# EAGLE design prototype2 (EAGLE 7.4.0)
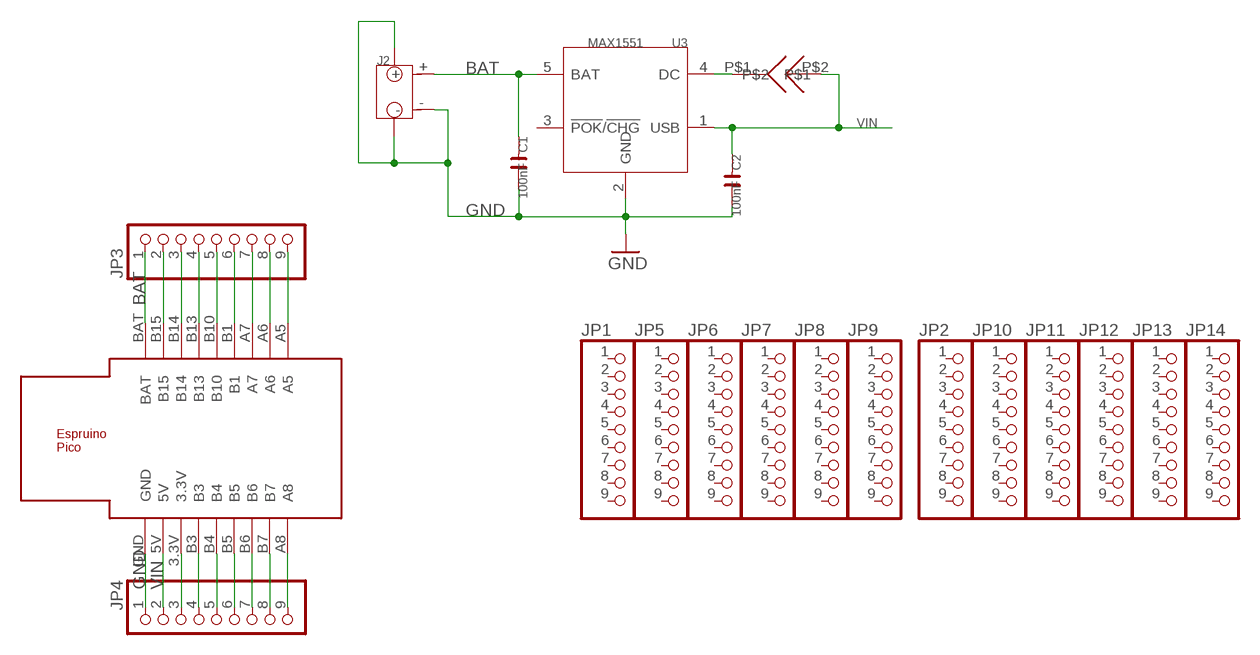
[diagram p0: schematic, sheet 1]

## Parts
C1  100nF  C-0603  [C0603]
C2  100nF  C-0603  [C0603]
J2  JST-2P-SMD-PW-3410050P1  [2P-SMD-2.0-90D]
JP1  PINHD-1X09_2.54-S  [1X09-S]
JP2  PINHD-1X09_2.54-S  [1X09-S]
JP3  PINHD-1X09_2.54-S  [1X09-S]
JP4  PINHD-1X09_2.54-S  [1X09-S]
JP5  PINHD-1X09_2.54-S  [1X09-S]
JP6  PINHD-1X09_2.54-S  [1X09-S]
JP7  PINHD-1X09_2.54-S  [1X09-S]
JP8  PINHD-1X09_2.54-S  [1X09-S]
JP9  PINHD-1X09_2.54-S  [1X09-S]
JP10  PINHD-1X09_2.54-S  [1X09-S]
JP11  PINHD-1X09_2.54-S  [1X09-S]
JP12  PINHD-1X09_2.54-S  [1X09-S]
JP13  PINHD-1X09_2.54-S  [1X09-S]
JP14  PINHD-1X09_2.54-S  [1X09-S]
U3  MAX1551  [SOT23-5]
U$1  ESPRUINO_PICO_0.1  [ESPRUINO_PICO_0.1]
U$4  SOLDERJUMPER  [SOLDERJUMPER]

## Nets
BAT: C1.1 J2.+ JP3.1 U3.5(BAT) U$1.BAT
GND: C1.2 C2.2 J2.3 J2.4 J2.- JP4.1 U3.2(GND) U$1.GND
N$2: U3.4(DC) U$4.P$1
N$7: JP4.3 U$1.3.3V
N$8: JP4.4 U$1.B3
N$10: JP4.5 U$1.B4
N$11: JP4.6 U$1.B5
N$12: JP4.7 U$1.B6
N$13: JP4.8 U$1.B7
N$14: JP4.9 U$1.A8
N$16: JP3.2 U$1.B15
N$17: JP3.3 U$1.B14
N$18: JP3.4 U$1.B13
N$19: JP3.5 U$1.B10
N$20: JP3.6 U$1.B1
N$21: JP3.7 U$1.A7
N$22: JP3.8 U$1.A6
N$23: JP3.9 U$1.A5
VIN [power]: C2.1 JP4.2 U3.1(USB) U$1.5V U$4.P$2
Unconnected: JP1.1 JP1.2 JP1.3 JP1.4 JP1.5 JP1.6 JP1.7 JP1.8 JP1.9 JP2.1 JP2.2 JP2.3 JP2.4 JP2.5 JP2.6 JP2.7 JP2.8 JP2.9 JP5.1 JP5.2 JP5.3 JP5.4 JP5.5 JP5.6 JP5.7 JP5.8 JP5.9 JP6.1 JP6.2 JP6.3 JP6.4 JP6.5 JP6.6 JP6.7 JP6.8 JP6.9 JP7.1 JP7.2 JP7.3 JP7.4 JP7.5 JP7.6 JP7.7 JP7.8 JP7.9 JP8.1 JP8.2 JP8.3 JP8.4 JP8.5 JP8.6 JP8.7 JP8.8 JP8.9 JP9.1 JP9.2 JP9.3 JP9.4 JP9.5 JP9.6 JP9.7 JP9.8 JP9.9 JP10.1 JP10.2 JP10.3 JP10.4 JP10.5 JP10.6 JP10.7 JP10.8 JP10.9 JP11.1 JP11.2 JP11.3 JP11.4 JP11.5 JP11.6 JP11.7 JP11.8 JP11.9 JP12.1 JP12.2 JP12.3 JP12.4 JP12.5 JP12.6 JP12.7 JP12.8 JP12.9 JP13.1 JP13.2 JP13.3 JP13.4 JP13.5 JP13.6 JP13.7 JP13.8 JP13.9 JP14.1 JP14.2 JP14.3 JP14.4 JP14.5 JP14.6 JP14.7 JP14.8 JP14.9 U3.3(!POK!/!CHG!)

## Library data of the parts
C1 C2 = OPL5:C*
J2 = OPL Eagle Library:JST-2P-SMD-PW
JP1-JP14 = pinhead-2:PINHD-1X09: PIN HEADER
U3 = template:MAX1551: SOT23 Dual-Input USB/AC Adapter 1-Cell Li+ Battery Chargers
U$1 = espruino_pico:ESPRUINO_PICO_0.1
U$4 = solder_jumper:SOLDERJUMPER

## Net classes
0 default: width 0.305 mm
1 power: width 0.406 mm

## Board
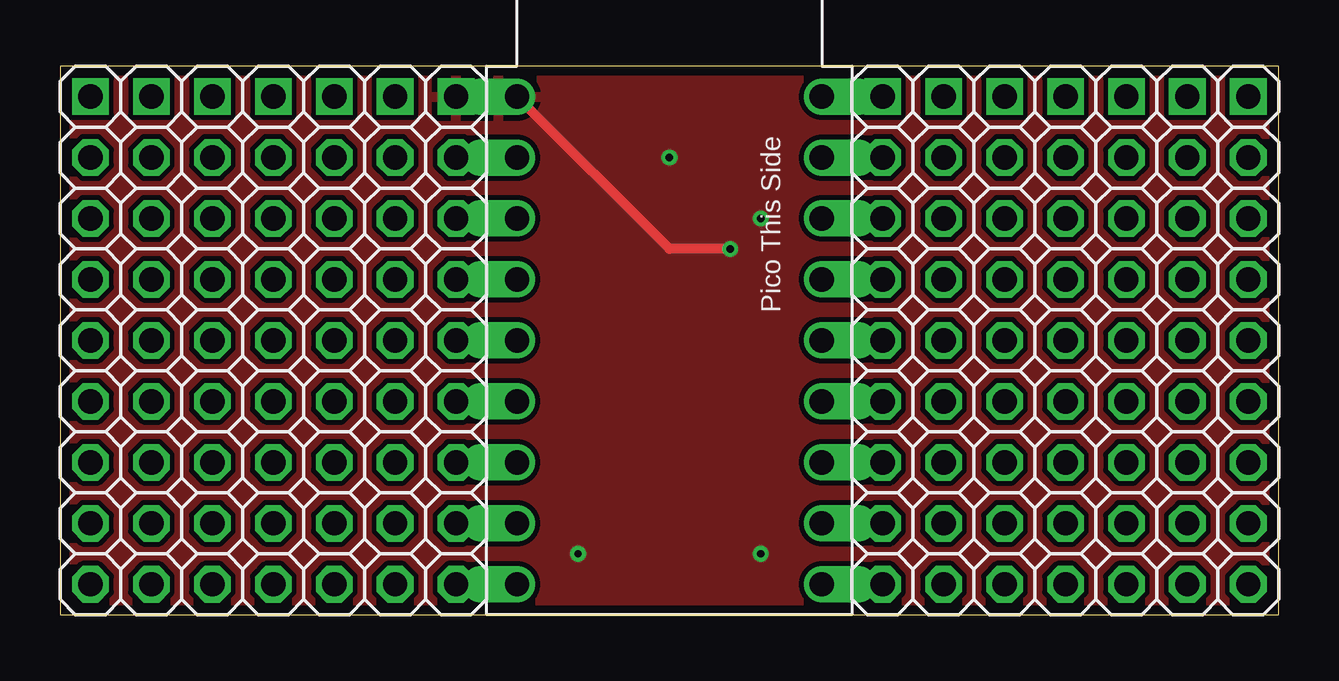
[diagram p1: board, top side]
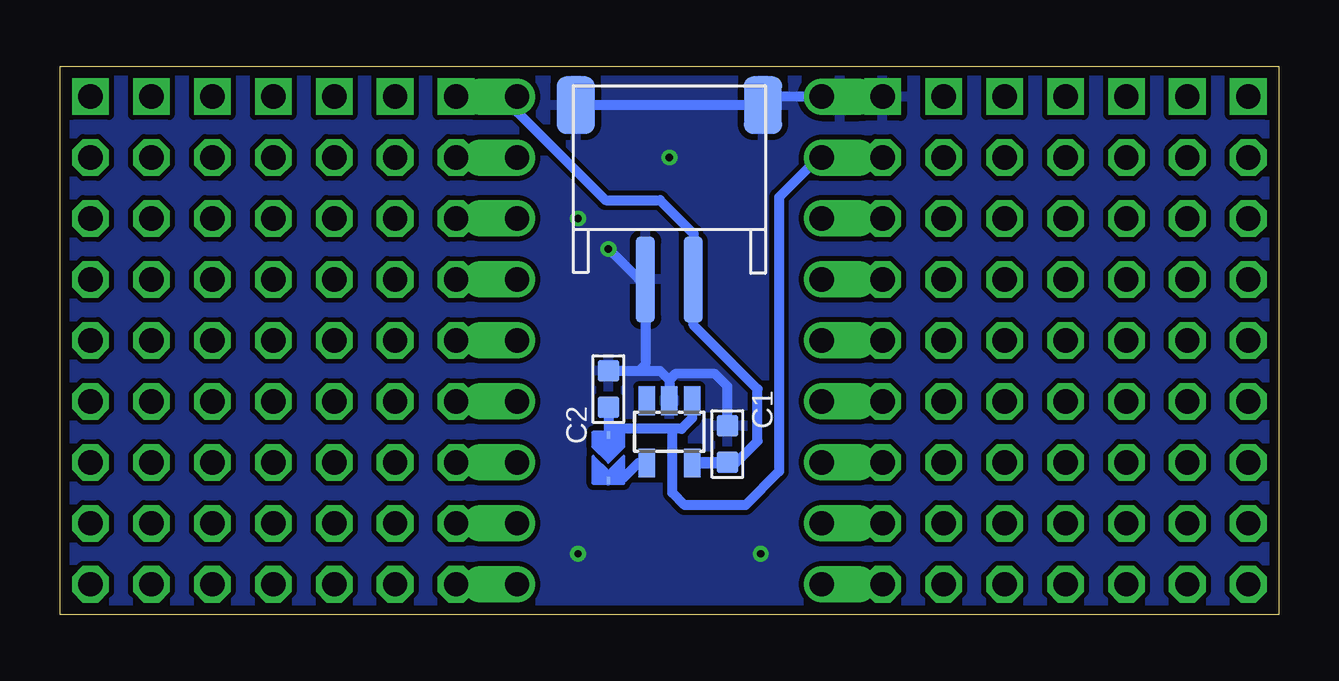
[diagram p2: board, bottom side, seen from below]

Size 50.8 x 22.86 mm. Coordinates in mm from the lower left corner, seen from the top.
Outline: 0,0 50.8,0 50.8,22.86 0,22.86 0,0
Copper layers (1*16): Top 0.0356mm / dielectric 1.5011mm / Bottom 0.0356mm
Design rules "oshpark": minimum track width 10mil, minimum drill 13mil, track to track 8mil, track to pad 6mil, pad to pad 6mil, via to via 6mil, smd to smd 6mil, copper to edge 15mil, drill to drill 6mil, minimum pad ring 7mil, minimum via ring 7mil, stop-mask expansion 4mil, vias tented up to drill 15mil, thermal gap 10mil

### Footprints (pad centres in the part's own frame; a part is rotated, then mirrored left to right if it is on the bottom)
C0603 = smd 0.889 x 0.889: 1 -0.762,0; 2 0.762,0
2P-SMD-2.0-90D = smd 1.6 x 2.4: 3 3.9,-2.181; 4 -3.9,-2.181 | smd 0.8 x 3.6: + -1,5.08; - 1,5.08
1X09-S = drill 1.016 square: 1 -10.16,0 | drill 1.016 octagon: 2 -7.62,0; 3 -5.08,0; 4 -2.54,0; 5 0,0; 6 2.54,0; 7 5.08,0; 8 7.62,0; 9 10.16,0
SOT23-5 = smd 0.69 x 1.2: 1 -0.95,-1.3; 2 0,-1.3; 3 0.95,-1.3; 4 0.95,1.3; 5 -0.95,1.3
ESPRUINO_PICO_0.1 = drill 1.016 offset: 3.3V -7.62,-6.35; 5V -10.16,-6.35; A5 7.62,6.35; A6 5.08,6.35; A7 2.54,6.35; A8 7.62,-6.35; B1 0,6.35; B3 -5.08,-6.35; B4 -2.54,-6.35; B5 0,-6.35; B6 2.54,-6.35; B7 5.08,-6.35; B10 -2.54,6.35; B13 -5.08,6.35; B14 -7.62,6.35; B15 -10.16,6.35; BAT -12.7,6.35; GND -12.7,-6.35
SOLDERJUMPER = smd 0.305 x 0.152: P$1 0.762,0; P$2 -1.143,0

### Placement (x,y rotation side)
C1  22.99,7.11 90 bottom
C2  27.94,9.4 90 bottom
J2  25.4,19.05 180 bottom
JP1  1.27,11.43 270 top
JP2  36.83,11.43 270 top
JP3  34.29,11.43 270 top
JP4  16.51,11.43 270 top
JP5  3.81,11.43 270 top
JP6  6.35,11.43 270 top
JP7  8.89,11.43 270 top
JP8  11.43,11.43 270 top
JP9  13.97,11.43 270 top
JP10  39.37,11.43 270 top
JP11  41.91,11.43 270 top
JP12  44.45,11.43 270 top
JP13  46.99,11.43 270 top
JP14  49.53,11.43 270 top
U3  25.4,7.62 180 bottom
U$1  25.4,8.89 270 top
U$4  27.94,6.35 270 bottom

### Tracks (layer width: path | path; a pad name or v marks a point on that pad's centre or on a via)
BAT
  Bottom 0.406: C1.1 24.45,6.35 U3.5 22.64,6.32 21.72,7.24 21.72,9.4 24.38,12.06 24.38,13.95 J2.+ 24.38,13.99 24.38,15.88 25.78,17.27 28.07,17.27 31.75,20.95 U$1.BAT
  Bottom 1.016: U$1.BAT JP3.1
GND  (via drill 0.3)
  Top 0.406: v27.94,15.24 25.4,15.24 U$1.GND
  Bottom 0.406: C2.2 26.67,10.16 | 26.67,10.16 25.78,10.16 25.4,9.78 | 25.4,9.78 U3.2 | C1.2 22.99,9.53 23.5,10.03 25.15,10.03 25.4,9.78 | U$1.GND 21.14,21.59 J2.4 J2.3 | 26.67,10.16 26.4,10.43 J2.- 26.67,13.97 v27.94,15.24
  Bottom 1.016: U$1.GND JP4.1
  other vias: 29.21,2.54 21.59,2.54 25.4,19.05 29.21,16.51
  pour Top: 0,22.86 50.8,22.86 50.8,0 0,-0.25
  pour Bottom: 0,22.86 50.8,22.86 50.8,0 0,0
N$2
  Bottom 0.406: U3.4 26.7,6.32 27.3,5.71 27.81,5.71 U$4.P$1
N$7
  Bottom 1.016: U$1.3.3V JP4.3
N$8
  Bottom 1.016: U$1.B3 JP4.4
N$10
  Bottom 1.016: U$1.B4 JP4.5
N$11
  Bottom 1.016: U$1.B5 JP4.6
N$12
  Bottom 1.016: U$1.B6 JP4.7
N$13
  Bottom 1.016: U$1.B7 JP4.8
N$14
  Bottom 1.016: U$1.A8 JP4.9
N$16
  Bottom 1.016: U$1.B15 JP3.2
N$17
  Bottom 1.016: U$1.B14 JP3.3
N$18
  Bottom 1.016: U$1.B13 JP3.4
N$19
  Bottom 1.016: U$1.B10 JP3.5
N$20
  Bottom 1.016: U$1.B1 JP3.6
N$21
  Bottom 1.016: U$1.A7 JP3.7
N$22
  Bottom 1.016: U$1.A6 JP3.8
N$23
  Bottom 1.016: U$1.A5 JP3.9
VIN
  Bottom 0.406: C2.1 U$4.P$2 27.69,7.75 25.4,7.75 | U3.1 24.45,8.19 24.89,7.75 25.4,7.75 | U$1.5V 19.18,19.05 20.83,17.4 20.83,5.97 22.23,4.57 24.77,4.57 25.27,5.08 25.27,7.62 25.4,7.75
  Bottom 1.016: U$1.5V JP4.2

### Text on the board
tNames: Pico This Side